# EAGLE design MRCS-MSS-Detector-Crossover (EAGLE 7.7.0)
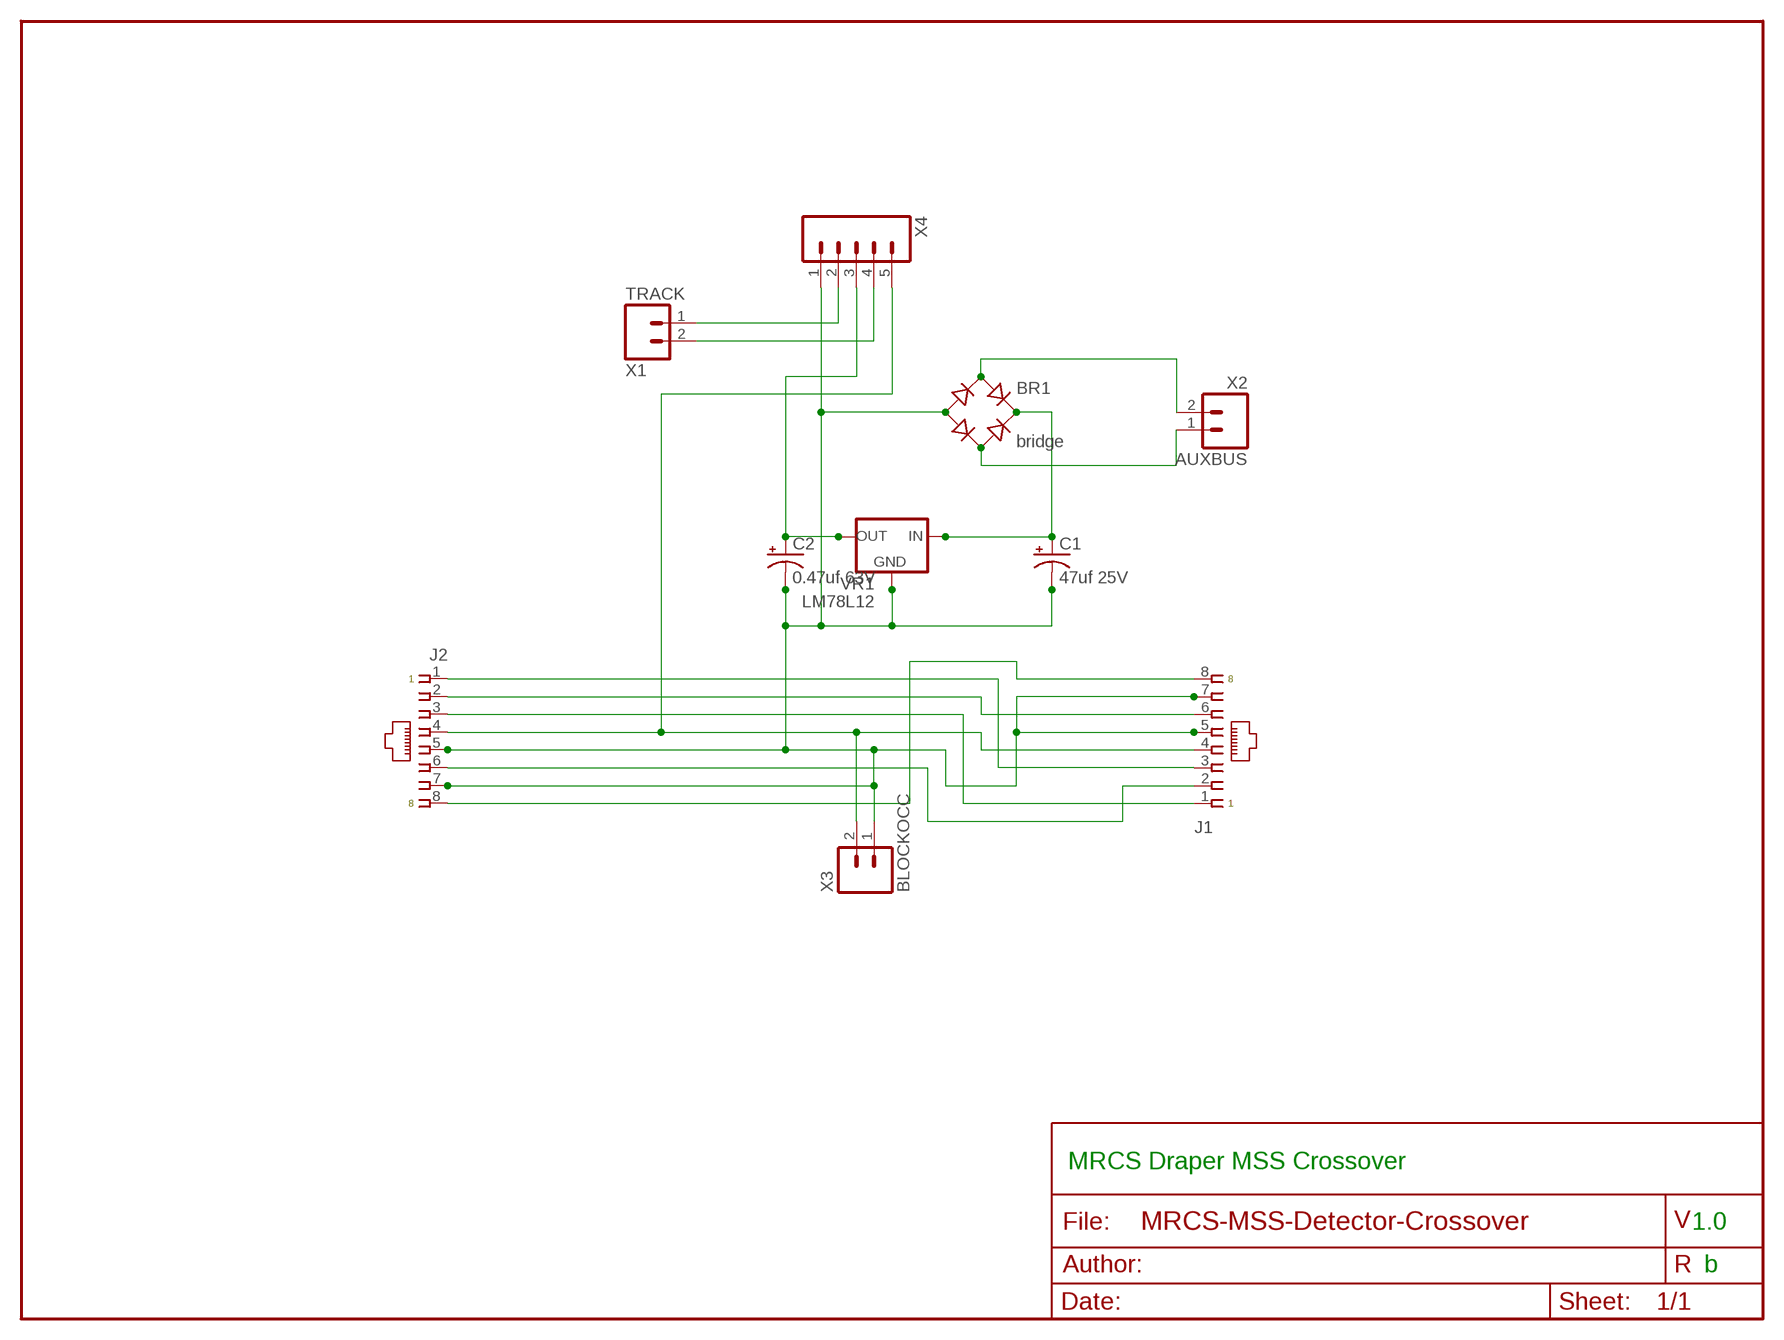
[diagram p0: schematic, sheet 1]

## Parts
BR1  bridge  DBRB1AG  [RB1A]
C1  47uf 25V  CAP-POLPTH-2.5MM  [E2.5-6]
C2  0.47uf 63V  CAP-POLPTH-2.5MM  [E2.5-6]
J1  CONNECTOR-RJ45-FRONT  [RJ45-NO-SHIELD]
J2  CONNECTOR-RJ45-FRONT  [RJ45-NO-SHIELD]
VR1  LM78L12  VREG-TO-92-12  [TO-92]
X1  TRACK  CONNECTOR-M025MM-LOCK  [SCREWTERMINAL-5MM-2]
X2  AUXBUS  CONNECTOR-M025MM-LOCK  [SCREWTERMINAL-5MM-2]
X3  BLOCKOCC  CONNECTOR-M025MM-LOCK  [SCREWTERMINAL-5MM-2]
X4  CONNECTOR-M051.56  [KK-156-5]

## Nets
AC1: BR1.AC1 X2.2(B)
AC2: BR1.AC2 X2.1(A)
GND: BR1.- C1.- C2.- J1.5 J1.7 J2.5 J2.7 VR1.1(GND) X3.1(A) X4.1
N$6: J1.3 J2.1
N$8: J1.6 J2.2
N$9: J1.1 J2.3
N$10: J1.4 J2.4 X3.2(B) X4.5
N$12: J1.2 J2.6
N$15: J1.8 J2.8
TRACK1: X1.1(A) X4.2
TRACK2: X1.2(B) X4.4
V12: C2.+ VR1.3(OUT) X4.3
VIN: BR1.+ C1.+ VR1.2(IN)

## Notes on the sheet
- MRCS Draper MSS Crossover
- 1.0
- b

## Library data of the parts
BR1 = SPCoast:DB?*G: Single Phase 1.0 AMP Glass Passivated Bridge Rectifier Taiwan Semiconductor Co.,Ltd. - TSC Source: http://www.taiwansemi.com/TSCbig5/ezcatfiles/cust/img/img/db101g.pdf http://www.ts.com.tw/db/pictures/modules/PDT/PDT060207001/DBLS201G.pdf
C1 C2 = SPCoast:CAP-POL*
J1 J2 = SPCoast:CONNECTOR-RJ45: Tyco CORCOM Modular RJ Jacks No Shield; AMP: 520151-4; OPL: none
VR1 = SPCoast:VREG-?-*: Voltage Regulator Standard linear regulator. 7805 uses IGO pinout LM1117 uses GOI pinout
X1-X3 = SPCoast:CONNECTOR-M02: PHOENIX CONNECTOR
X4 = SPCoast:CONNECTOR-M05: Header 5 Standard 5-pin 0.1" header. Use with straight break away headers (SKU : PRT-00116), right angle break away headers (PRT-00553), swiss pins (PRT-00743), machine pins (PRT-00117), and female headers (PRT-00115). Molex polarized connector foot print use with SKU : PRT-08230 with associated crimp pins and housings.

## Net classes
0 default: clearance 0.205 mm

## Board
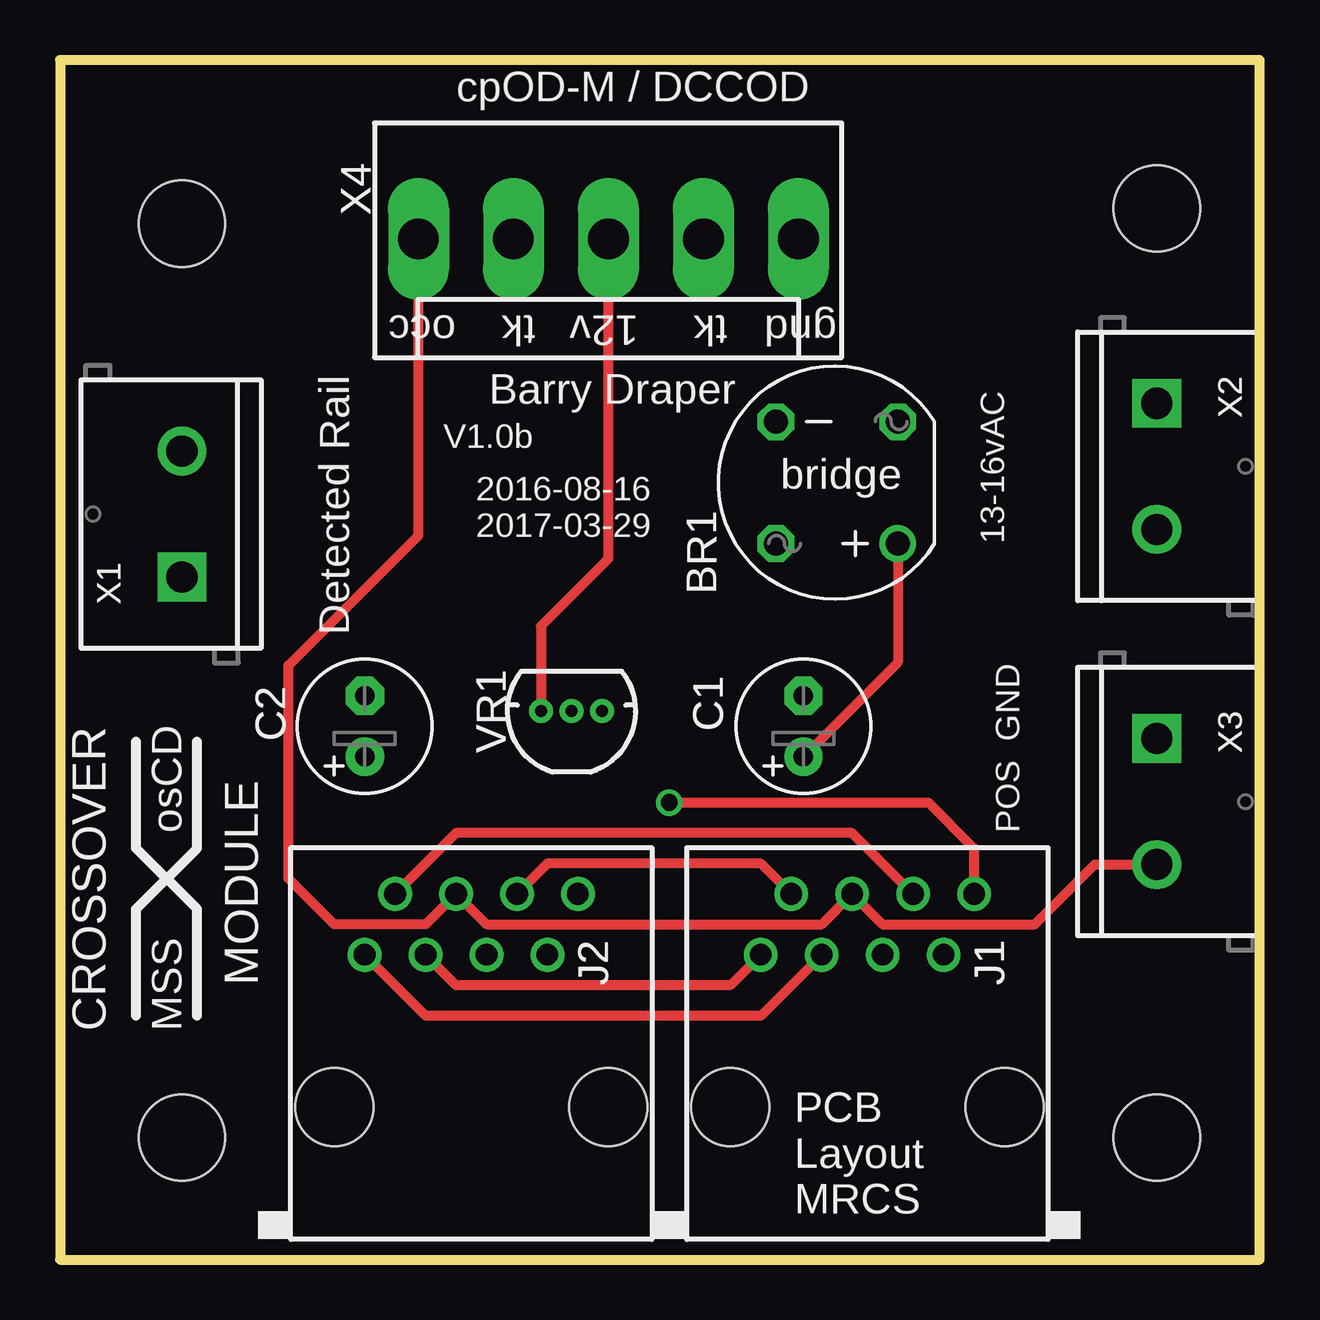
[diagram p1: board, top side]
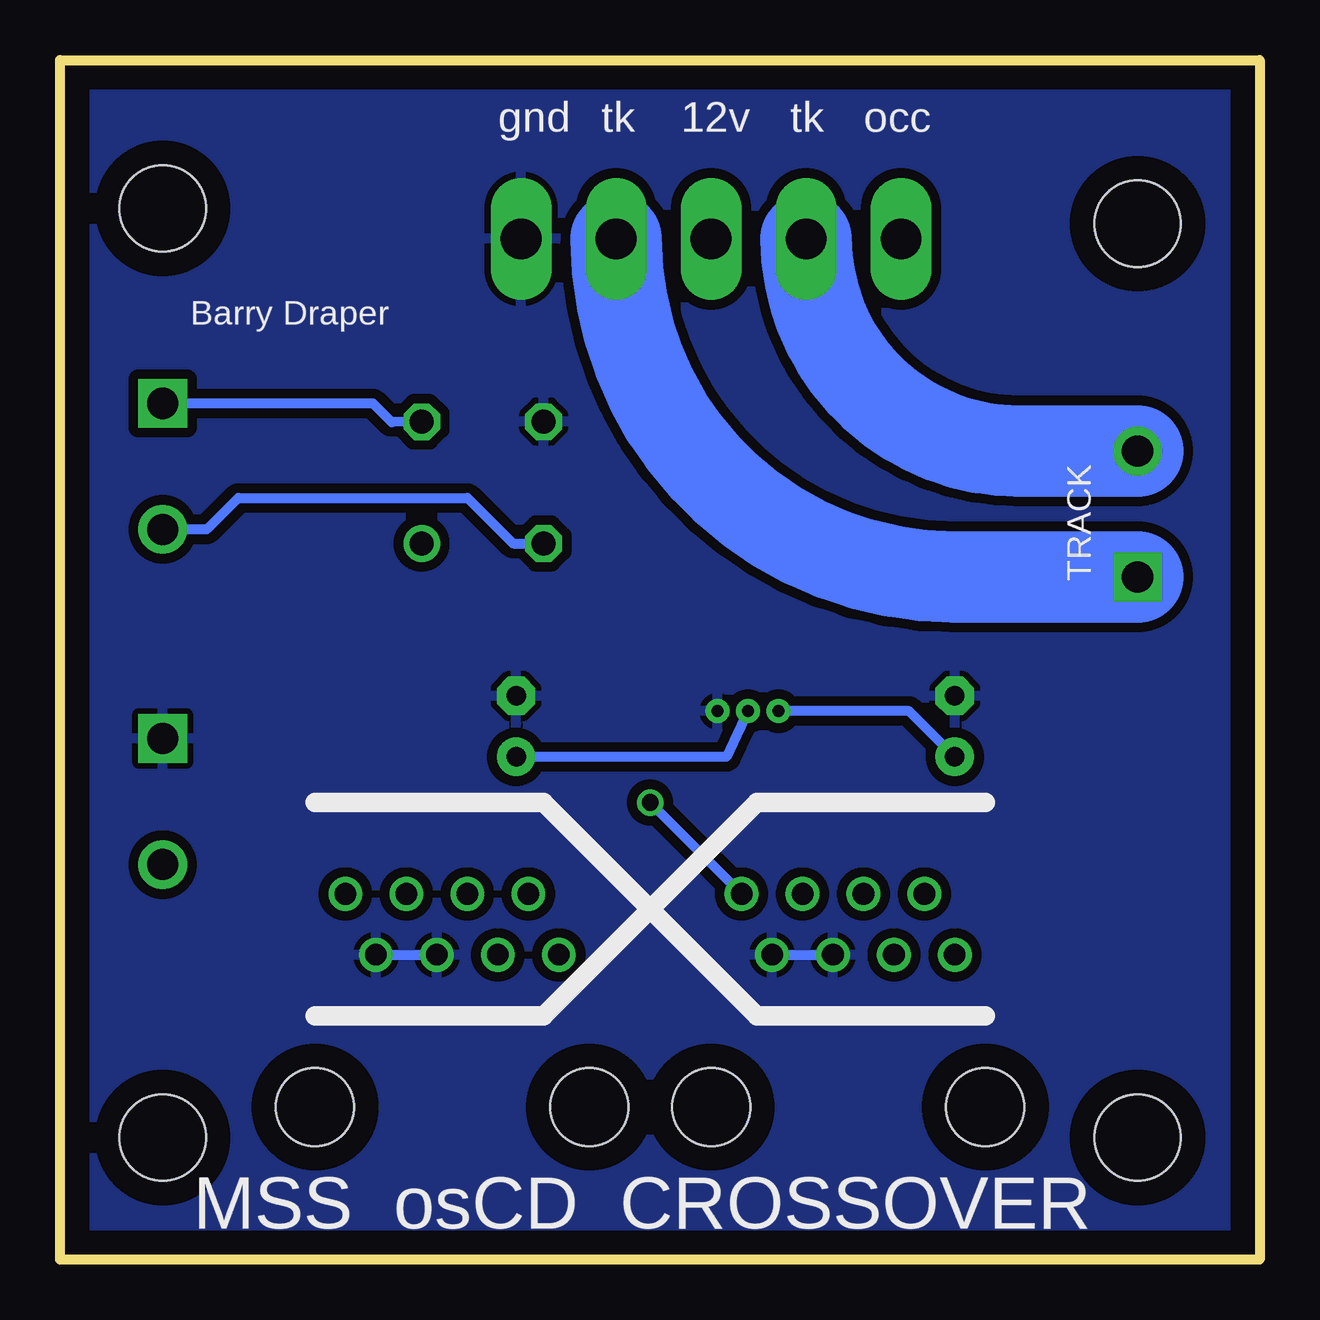
[diagram p2: board, bottom side, seen from below]

Size 50 x 50 mm. Coordinates in mm from the lower left corner, seen from the top.
Outline: 0,50 0,0 50,0 50,50 0,50
Copper layers (1*16): Top 0.035mm / dielectric 1.5mm / Bottom 0.035mm
Design rules "default": minimum track width 10mil, minimum drill 24mil, track to track 8mil, track to pad 8mil, pad to pad 8mil, via to via 8mil, smd to smd 8mil, copper to edge 40mil, drill to drill 8mil, minimum pad ring 10mil, minimum via ring 8mil, stop-mask expansion 4mil, vias tented up to drill 0mil, thermal gap 10mil
Holes 3.6 mm at 5.08,43.18 45.72,43.81 45.72,5.08 5.08,5.08

### Footprints (pad centres in the part's own frame; a part is rotated, then mirrored left to right if it is on the bottom)
RB1A = drill 1.016: + -2.54,2.54 | drill 1.016 octagon: - 2.54,-2.54; AC1 2.54,2.54; AC2 -2.54,-2.54
E2.5-6 = drill 0.813 pad 1.6: + -1.27,0 | drill 0.813 pad 1.6 octagon: - 1.27,0
RJ45-NO-SHIELD = drill 0.9 pad 1.4: 1 -4.445,6.35; 2 -3.175,8.89; 3 -1.905,6.35; 4 -0.635,8.89; 5 0.635,6.35; 6 1.905,8.89; 7 3.175,6.35; 8 4.445,8.89 | hole 3.251: -5.715,0; 5.715,0
TO-92 = drill 0.5: 1 -1.27,0; 2 0,0; 3 1.27,0
SCREWTERMINAL-5MM-2 = drill 1.3 pad 2.032 square: 1 -0.127,0 | drill 1.3 pad 2.032: 2 5.127,0
KK-156-5 = drill 1.7 pad 2.184 long: 1 -7.92,0; 2 -3.96,0; 3 0,0; 4 3.96,0; 5 7.92,0

### Placement (x,y rotation side)
BR1  32.38,32.38 180 top
C1  30.99,22.23 90 top
C2  12.7,22.23 90 top
J1  33.66,6.35 0 top
J2  17.14,6.35 0 top
VR1  21.32,22.86 180 top
X1  5.08,28.57 90 top
X2  45.72,35.56 270 top
X3  45.72,21.59 270 top
X4  22.86,42.55 180 top

### Tracks (layer width: path | path; a pad name or v marks a point on that pad's centre or on a via)
AC1
  Bottom 0.406: BR1.AC1 31.11,29.84 33.02,31.75 42.57,31.75 43.89,30.43 X2.2
AC2
  Bottom 0.406: BR1.AC2 36.17,34.9 36.96,35.69 X2.1
GND
  Bottom 0.406: J1.7 J1.5 | J2.7 J2.5
  pour Bottom (isolate 0.406): 0.64,50.16 0.64,0 49.53,0 49.53,50.16
N$6
  Top 0.406: J2.1 15.24,10.16 29.21,10.16 J1.3
N$8
  Top 0.406: J2.2 16.51,17.78 33.02,17.78 J1.6
N$9
  Top 0.406: J2.3 16.51,11.43 27.94,11.43 J1.1
N$10
  Top 0.406: X3.2 43.13,16.46 40.64,13.97 34.29,13.97 J1.4 31.75,13.97 17.78,13.97 J2.4 15.24,13.97 11.43,13.97 9.53,15.88 9.53,24.77 14.94,30.18 X4.5
N$12
  Top 0.406: J2.6 20.32,16.51 29.21,16.51 J1.2
N$15  (via drill 0.7)
  Top 0.406: v25.4,19.05 36.2,19.05 38.1,17.14 J1.8
  Bottom 0.406: J2.8 v25.4,19.05
TRACK1
  Bottom 3.81: X1.1 12.72,28.45 arc90 X4.2
TRACK2
  Bottom 3.81: X1.2 10.06,33.7 arc90 X4.4
V12
  Top 0.406: VR1.3 20.05,26.4 22.86,29.21 X4.3
  Bottom 0.406: C2.+ 14.61,22.86 VR1.3
VIN
  Top 0.406: BR1.+ 34.92,24.89 C1.+
  Bottom 0.406: VR1.2 22.23,20.95 C1.+

### Text on the board
tPlace: cpOD-M / DCCOD | occ | tk | 12v | tk | gnd | Barry Draper | V1.0b | 2016-08-16 / 2017-03-29 | 13-16vAC | Detected Rail | osCD | POS GND | MODULE | CROSSOVER | MSS | PCB / Layout / MRCS
bPlace: occ | tk | 12v | tk | gnd | Barry Draper | TRACK | MSS osCD CROSSOVER
_tNames: X4 | X2 | BR1 | X1 | VR1 | X3 | C2 | C1 | J2 | J1